# Altium schematic sheet NAND.SchDoc
size A4
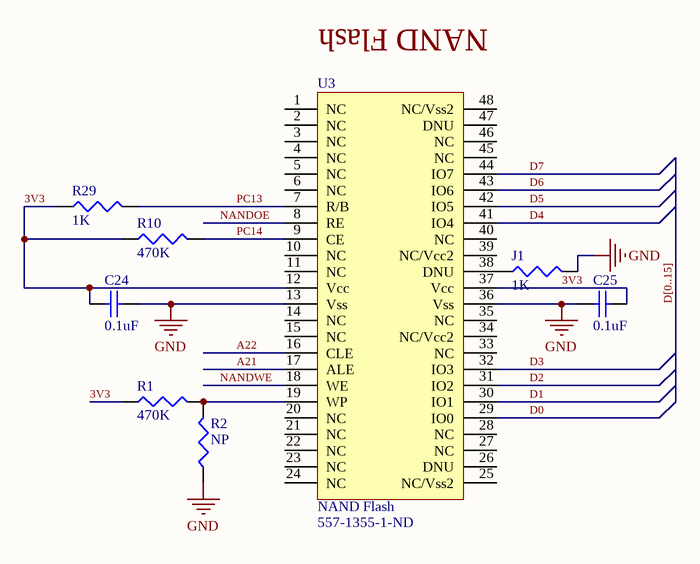
[diagram p0: NAND.SchDoc]

## Parts
C24  value 0.1uF  [CAPC2008X06N]  (hidden comment: Kemet_0805_a_0.1uF)
C25  value 0.1uF  [CAPC2008X06N]  (hidden comment: Kemet_0805_a_0.1uF)
J1  value 1K  [RES0805]  (hidden comment: Susumu_0805_b1_1K)
R1  value 470K  [RES0805]  (hidden comment: Susumu_0805_b3_470K)
R2  value NP  [RES0805]  (hidden comment: 0805_NP)
R10  value 470K  [RES0805]  (hidden comment: Susumu_0805_b3_470K)
R29  value 1K  [RES0805]  (hidden comment: Susumu_0805_b1_1K)
U3  NAND Flash  Supplier Part Number 1: 557-1355-1-ND  [NAND Flash]

## Nets
GND: C24.2 C25.1 J1.2 R2.1 U3.13(Vss) U3.36(Vss)
3V3: C24.1 C25.2 R1.1 R10.1 R29.1 U3.12(Vcc) U3.37(Vcc)
A21: U3.17(ALE)
A22: U3.16(CLE)
D0: U3.29(IO0)
D1: U3.30(IO1)
D2: U3.31(IO2)
D3: U3.32(IO3)
D4: U3.41(IO4)
D5: U3.42(IO5)
D6: U3.43(IO6)
D7: U3.44(IO7)
NANDOE: U3.8(RE)
NANDWE: U3.18(WE)
PC13: R29.2 U3.7(R/B)
PC14: R10.2 U3.9(CE)
NetJ1_1: J1.1 U3.38(DNU)
NetR1_2: R1.2 R2.2 U3.19(WP)

Not connected (* = marked no-connect by the designer): U3 1(NC) 2(NC) 3(NC) 4(NC) 5(NC) 6(NC) 10(NC) 11(NC) 14(NC) 15(NC) 20(NC) 21(NC) 22(NC) 23(NC) 24(NC) 25(NC/Vss2) 26(DNU) 27(NC) 28(NC) 33(NC) 34(NC/Vcc2) 35(NC) 39(NC/Vcc2) 40(NC) 45(NC) 46(NC) 47(DNU) 48(NC/Vss2)

## Buses and harness runs
bus D[0..15]

## Notes on the sheet
- (near U3) NAND Flash

## Library data of the parts
C24 C25 = Kemet_0805_a_0.1uF: CAP CER 0.1UF 50V 10% X7R 0805; Supplier 1: Digi-Key; Supplier Part Number 1: 399-1170-1-ND
J1 R29 = Susumu_0805_b1_1K: RES 1.0K OHM 1/10W .5% 0805 SMD; Supplier 1: Digi-Key; Supplier Part Number 1: RR12P1.0KDCT-ND
R1 R10 = Susumu_0805_b3_470K: RES 470K OHM 1/10W .5% 0805 SMD; Supplier 1: Digi-Key; Supplier Part Number 1: RR12P470KDCT-ND
R2 = 0805_NP: No populate
U3 = NAND Flash: NAND Flash TSOP48; Manufacturer: Micron Technology INC.; Supplier 1: Digi-Key